# EAGLE schematic PCBPlates_v17 (EAGLE 9.7.0)
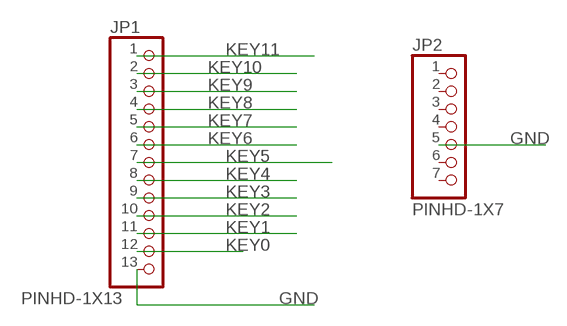
[diagram p0: schematic, sheet 1]

## Parts
JP1  PINHD-1X13  [1X13]
JP2  PINHD-1X7  [1X07]

## Nets
GND: JP1.13 JP2.5
KEY0: JP1.12
KEY1: JP1.11
KEY2: JP1.10
KEY3: JP1.9
KEY4: JP1.8
KEY5: JP1.7
KEY6: JP1.6
KEY7: JP1.5
KEY8: JP1.4
KEY9: JP1.3
KEY10: JP1.2
KEY11: JP1.1
Unconnected: JP2.1 JP2.2 JP2.3 JP2.4 JP2.6 JP2.7

## Library data of the parts
JP1 = Connector:PINHD-1X13: PIN HEADER; CATEGORY: CONNECTOR; SUB-CATEGORY: PIN-HEADER
JP2 = Connector:PINHD-1X7: PIN HEADER; CATEGORY: CONNECTOR; SUB-CATEGORY: PIN-HEADER